# EAGLE schematic Question2_Hw5 (EAGLE 9.6.2)
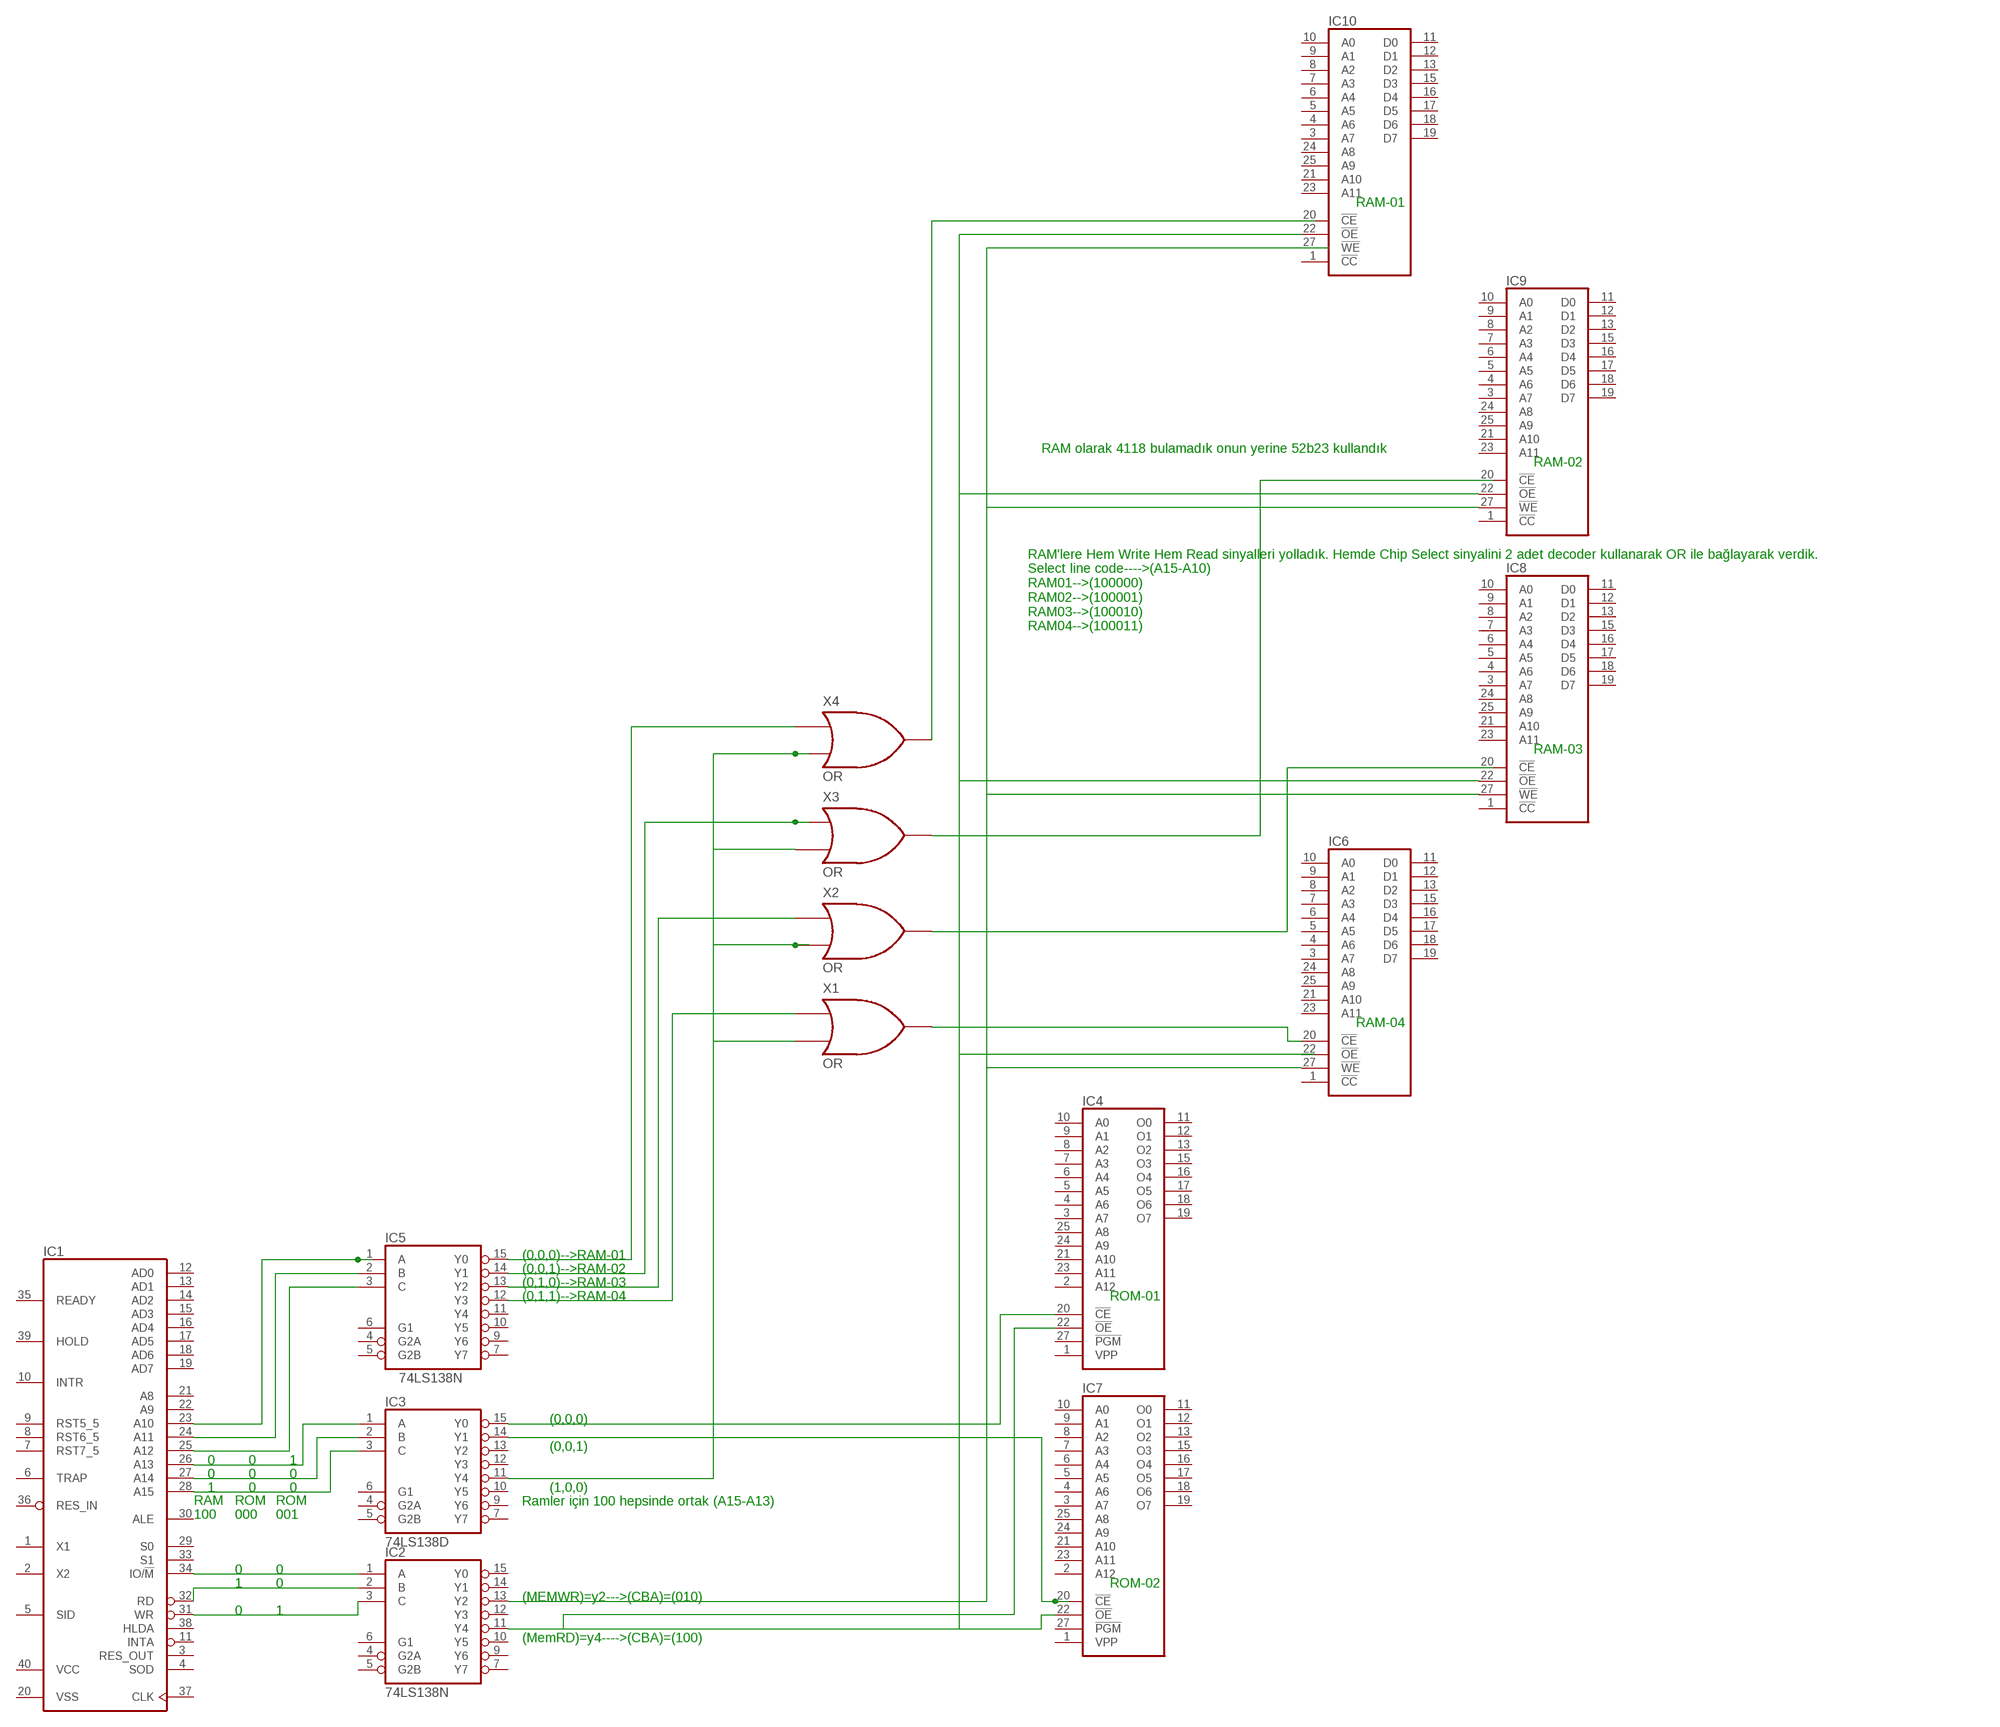
[diagram p0: schematic, sheet 1]

## Parts
IC1  8085  [DIL40]
IC2  74LS138N  [DIL16]
IC3  74LS138D  [SO16]
IC4  2764  [DIL28]
IC5  74LS138N  [DIL16]
IC6  52B23  [DIL28]
IC7  2764  [DIL28]
IC8  52B23  [DIL28]
IC9  52B23  [DIL28]
IC10  52B23  [DIL28]
X1  OR  (no package)
X2  OR  (no package)
X3  OR  (no package)
X4  OR  (no package)

## Nets
N$1: IC1.34(IO/!M) IC2.1(A)
N$2: IC1.32(RD) IC2.2(B)
N$3: IC1.31(WR) IC2.3(C)
N$4: IC2.11(Y4) IC4.22(!OE) IC7.22(!OE) IC8.22(!OE) IC9.22(!OE) IC10.22(!OE)
N$5: IC3.14(Y1) IC7.20(!CE)
N$6: IC1.28(A15) IC3.3(C)
N$7: IC1.27(A14) IC3.2(B)
N$8: IC1.26(A13) IC3.1(A)
N$9: IC1.25(A12) IC5.3(C)
N$10: IC1.24(A11) IC5.2(B)
N$11: IC1.23(A10) IC5.1(A)
N$12: IC3.11(Y4) X1.B X2.B X3.B X4.B
N$13: IC5.15(Y0) X4.A
N$14: IC5.14(Y1) X3.A
N$15: IC5.13(Y2) X2.A
N$16: IC5.12(Y3) X1.A
N$17: IC6.20(!CE) X1.Y
N$18: X2.Y
N$19: X3.Y
N$20: X4.Y
N$32: IC3.15(Y0) IC4.20(!CE)
N$33: IC2.13(Y2) IC6.27(!WE) IC8.27(!WE) IC9.27(!WE)
Unconnected: IC1.1(X1) IC1.2(X2) IC1.3(RES_OUT) IC1.4(SOD) IC1.5(SID) IC1.6(TRAP) IC1.7(RST7_5) IC1.8(RST6_5) IC1.9(RST5_5) IC1.10(INTR) IC1.11(INTA) IC1.12(AD0) IC1.13(AD1) IC1.14(AD2) IC1.15(AD3) IC1.16(AD4) IC1.17(AD5) IC1.18(AD6) IC1.19(AD7) IC1.21(A8) IC1.22(A9) IC1.29(S0) IC1.30(ALE) IC1.33(S1) IC1.35(READY) IC1.36(RES_IN) IC1.37(CLK) IC1.38(HLDA) IC1.39(HOLD) IC2.4(G2A) IC2.5(G2B) IC2.6(G1) IC2.7(Y7) IC2.9(Y6) IC2.10(Y5) IC2.12(Y3) IC2.14(Y1) IC2.15(Y0) IC3.4(G2A) IC3.5(G2B) IC3.6(G1) IC3.7(Y7) IC3.9(Y6) IC3.10(Y5) IC3.12(Y3) IC3.13(Y2) IC4.1(VPP) IC4.2(A12) IC4.3(A7) IC4.4(A6) IC4.5(A5) IC4.6(A4) IC4.7(A3) IC4.8(A2) IC4.9(A1) IC4.10(A0) IC4.11(O0) IC4.12(O1) IC4.13(O2) IC4.15(O3) IC4.16(O4) IC4.17(O5) IC4.18(O6) IC4.19(O7) IC4.21(A10) IC4.23(A11) IC4.24(A9) IC4.25(A8) IC4.27(!PGM) IC5.4(G2A) IC5.5(G2B) IC5.6(G1) IC5.7(Y7) IC5.9(Y6) IC5.10(Y5) IC5.11(Y4) IC6.1(!CC) IC6.3(A7) IC6.4(A6) IC6.5(A5) IC6.6(A4) IC6.7(A3) IC6.8(A2) IC6.9(A1) IC6.10(A0) IC6.11(D0) IC6.12(D1) IC6.13(D2) IC6.15(D3) IC6.16(D4) IC6.17(D5) IC6.18(D6) IC6.19(D7) IC6.21(A10) IC6.22(!OE) IC6.23(A11) IC6.24(A8) IC6.25(A9) IC7.1(VPP) IC7.2(A12) IC7.3(A7) IC7.4(A6) IC7.5(A5) IC7.6(A4) IC7.7(A3) IC7.8(A2) IC7.9(A1) IC7.10(A0) IC7.11(O0) IC7.12(O1) IC7.13(O2) IC7.15(O3) IC7.16(O4) IC7.17(O5) IC7.18(O6) IC7.19(O7) IC7.21(A10) IC7.23(A11) IC7.24(A9) IC7.25(A8) IC7.27(!PGM) IC8.1(!CC) IC8.3(A7) IC8.4(A6) IC8.5(A5) IC8.6(A4) IC8.7(A3) IC8.8(A2) IC8.9(A1) IC8.10(A0) IC8.11(D0) IC8.12(D1) IC8.13(D2) IC8.15(D3) IC8.16(D4) IC8.17(D5) IC8.18(D6) IC8.19(D7) IC8.20(!CE) IC8.21(A10) IC8.23(A11) IC8.24(A8) IC8.25(A9) IC9.1(!CC) IC9.3(A7) IC9.4(A6) IC9.5(A5) IC9.6(A4) IC9.7(A3) IC9.8(A2) IC9.9(A1) IC9.10(A0) IC9.11(D0) IC9.12(D1) IC9.13(D2) IC9.15(D3) IC9.16(D4) IC9.17(D5) IC9.18(D6) IC9.19(D7) IC9.20(!CE) IC9.21(A10) IC9.23(A11) IC9.24(A8) IC9.25(A9) IC10.1(!CC) IC10.3(A7) IC10.4(A6) IC10.5(A5) IC10.6(A4) IC10.7(A3) IC10.8(A2) IC10.9(A1) IC10.10(A0) IC10.11(D0) IC10.12(D1) IC10.13(D2) IC10.15(D3) IC10.16(D4) IC10.17(D5) IC10.18(D6) IC10.19(D7) IC10.20(!CE) IC10.21(A10) IC10.23(A11) IC10.24(A8) IC10.25(A9) IC10.27(!WE)

## Notes on the sheet
- RAM-01
- RAM olarak 4118 bulamadık onun yerine 52b23 kullandık
- RAM-02
- RAM'lere Hem Write Hem Read sinyalleri yolladık. Hemde Chip Select sinyalini 2 adet decoder kullanarak OR ile bağlayarak verdik.
  Select line code---->(A15-A10)
  RAM01-->(100000) 
  RAM02-->(100001)
  RAM03-->(100010)
  RAM04-->(100011)
- RAM-03
- RAM-04
- (0,0,0)-->RAM-01
- (0,0,1)-->RAM-02
- (0,1,0)-->RAM-03
- (0,1,1)-->RAM-04 | ROM-01
- (0,0,0)
- (0,0,1)
- 0 | 0 | 1
- 0 | 0 | 0
- 1 | 0 | 0 | (1,0,0)
- Ramler için 100 hepsinde ortak (A15-A13)
- RAM
  100
- ROM
  000
- ROM
  001
- 0 | 0
- 1 | 0 | ROM-02
- (MEMWR)=y2--->(CBA)=(010)
- 0 | 1
- (MemRD)=y4---->(CBA)=(100)

## Power pins joined to a net without a drawn wire
GND: IC2.8(GND) IC3.8(GND) IC4.14(GND) IC5.8(GND) IC6.14(GND) IC7.14(GND) IC8.14(GND) IC9.14(GND) IC10.14(GND)
VCC: IC1.40(VCC) IC2.16(VCC) IC3.16(VCC) IC4.28(VCC) IC5.16(VCC) IC6.28(VCC) IC7.28(VCC) IC8.28(VCC) IC9.28(VCC) IC10.28(VCC)
VSS: IC1.20(VSS)

## Library data of the parts
IC1 = micro-intel:8085: MICROCOMPUTER/PERIPHERAL DEVICE; OC_FARNELL: unknown; OC_NEWARK: unknown
IC2 IC3 IC5 = 74xx-eu:74*138: 3-line to 8-line DECODER/DEMULTIPLEXER
IC4 IC7 = memory:2764: MEMORY
IC6 IC8-IC10 = memory:52B23: MEMORY
X1-X4 = ngspice-digital:OR: 2 input logic OR gate